# Altium project Matrix.PrjPCB
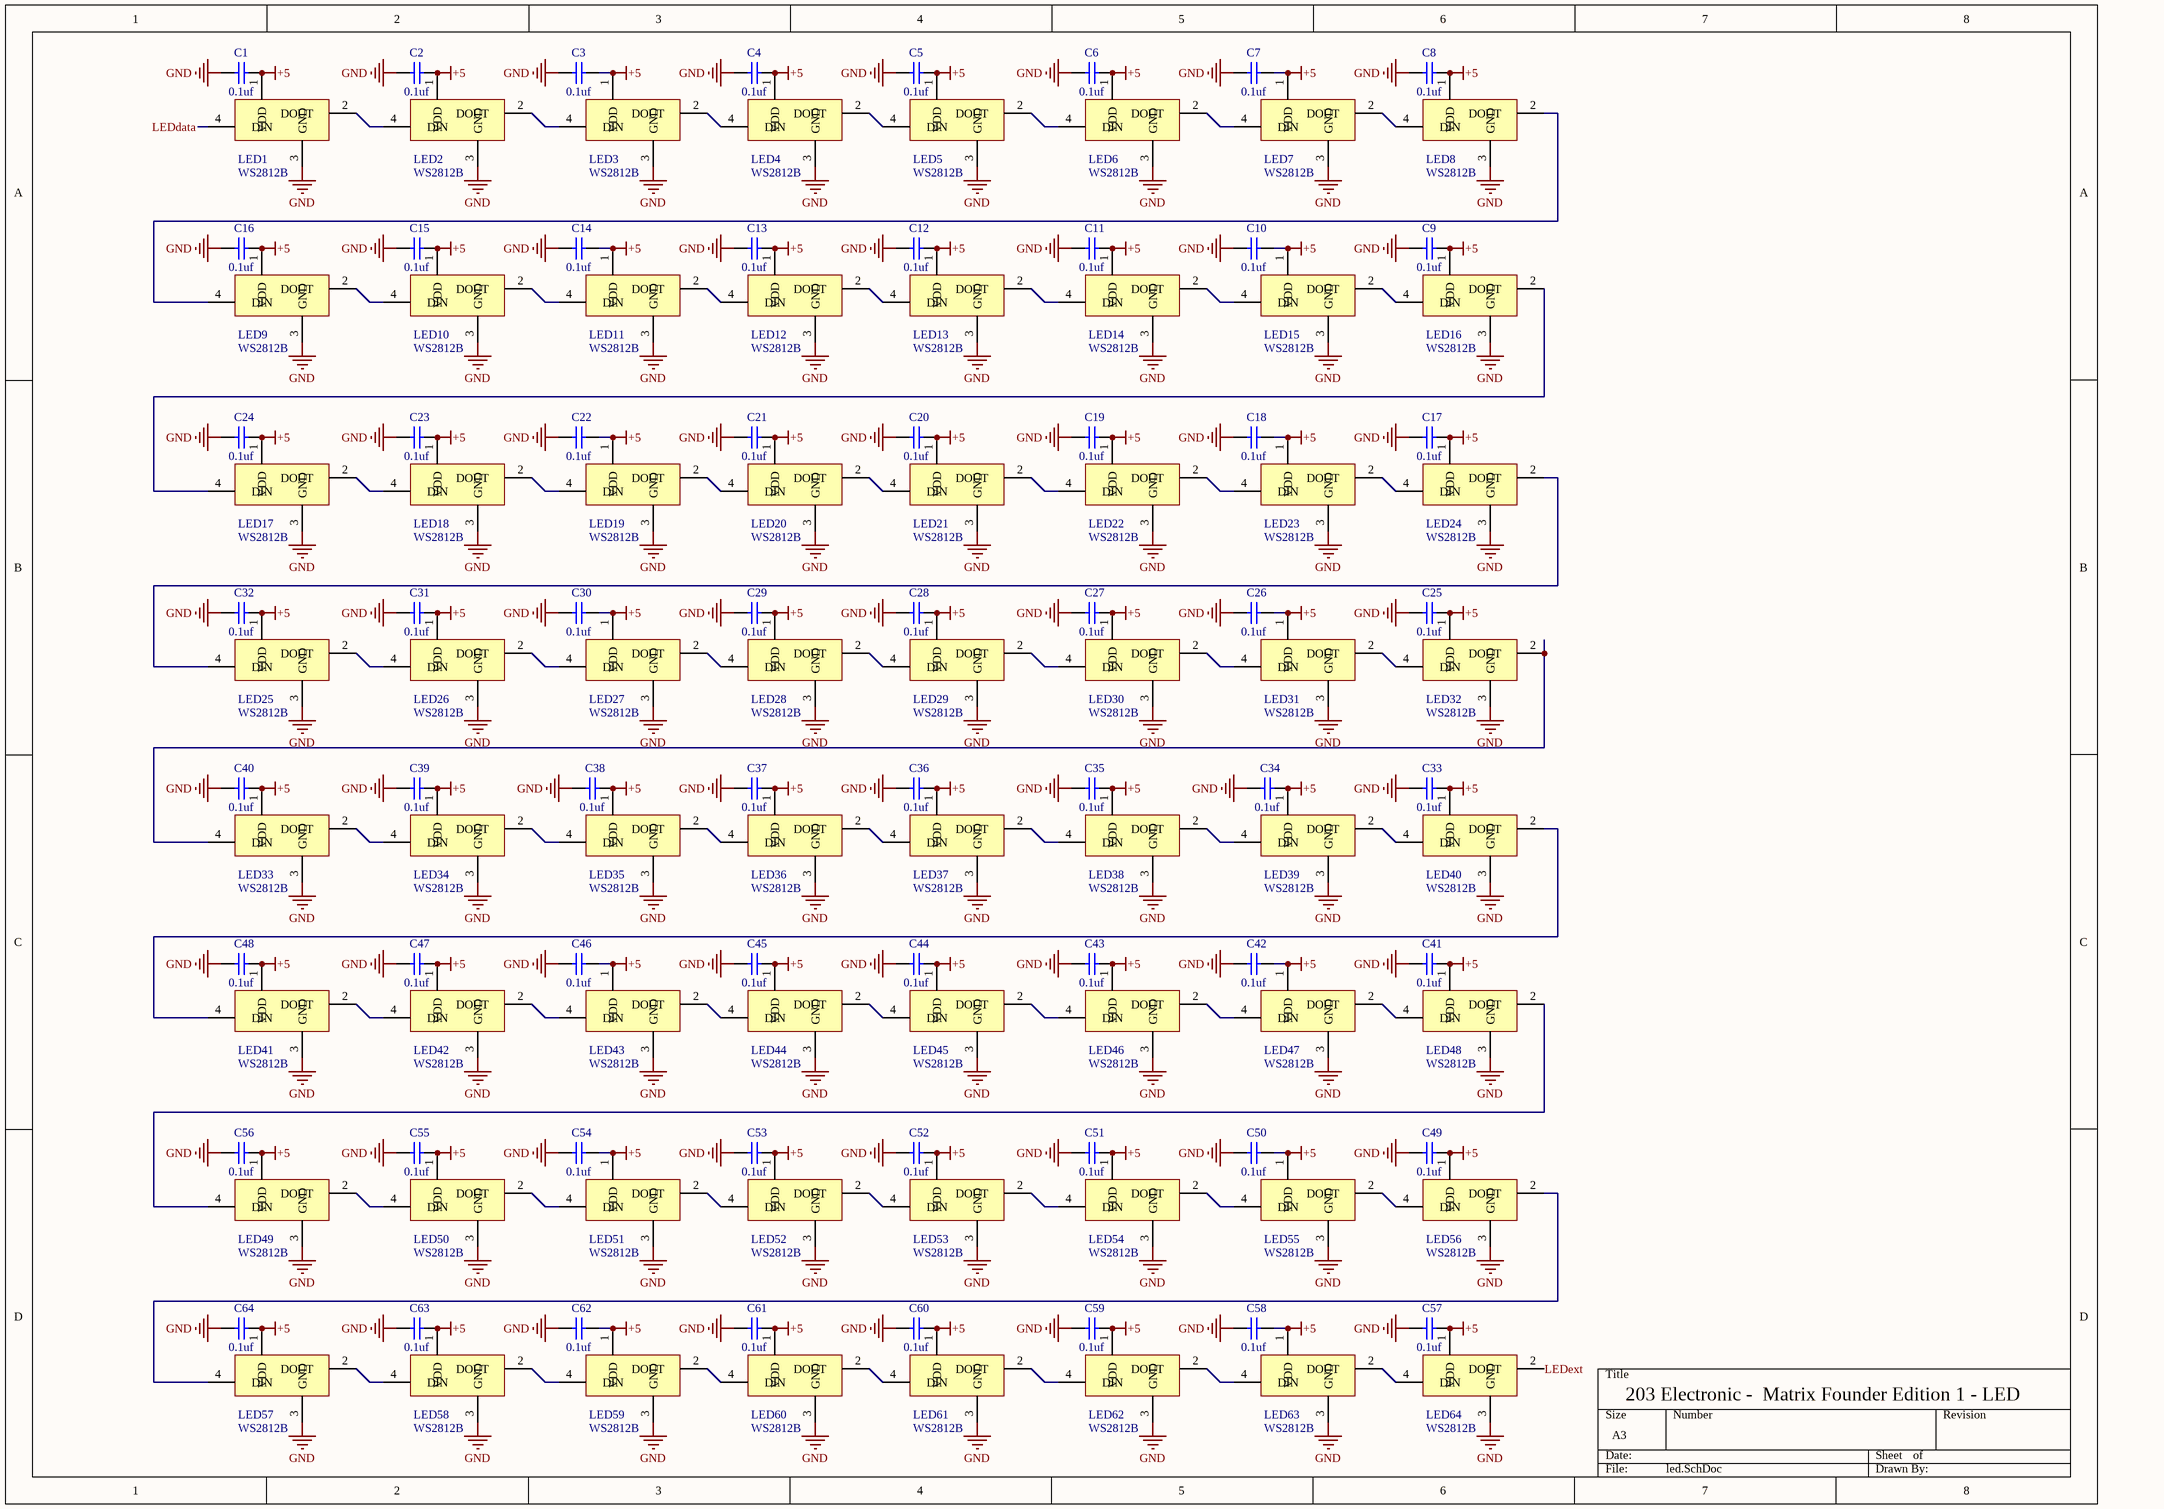
[diagram p0: led.SchDoc]
3 sheets, 303 parts. Net scope: global (net labels, ports and power ports of the same name join across sheets).
Board file: Matrix.PcbDoc
Sheets:
  led.SchDoc
  matrixkeypad.SchDoc
  MCU.SchDoc

## Sheet led.SchDoc
size A3

### Parts
(Parts that share a designator on the sheet are numbered #1, #2 ... from top to bottom, then left to right.)
C1#1  value 0.1uf  [0603 res]  (hidden comment: Cap Semi)
C2#1  value 0.1uf  [0603 res]  (hidden comment: Cap Semi)
C3#1  value 0.1uf  [0603 res]  (hidden comment: Cap Semi)
C4#1  value 0.1uf  [0603 res]  (hidden comment: Cap Semi)
C5#1  value 0.1uf  [0603 res]  (hidden comment: Cap Semi)
C6#1  value 0.1uf  [0603 res]  (hidden comment: Cap Semi)
C7#1  value 0.1uf  [0603 res]  (hidden comment: Cap Semi)
C8#1  value 0.1uf  [0603 res]  (hidden comment: Cap Semi)
C9#1  value 0.1uf  [0603 res]  (hidden comment: Cap Semi)
C10#1  value 0.1uf  [0603 res]  (hidden comment: Cap Semi)
C11#1  value 0.1uf  [0603 res]  (hidden comment: Cap Semi)
C12#1  value 0.1uf  [0603 res]  (hidden comment: Cap Semi)
C13  value 0.1uf  [0603 res]  (hidden comment: Cap Semi)
C14  value 0.1uf  [0603 res]  (hidden comment: Cap Semi)
C15  value 0.1uf  [0603 res]  (hidden comment: Cap Semi)
C16  value 0.1uf  [0603 res]  (hidden comment: Cap Semi)
C17  value 0.1uf  [0603 res]  (hidden comment: Cap Semi)
C18  value 0.1uf  [0603 res]  (hidden comment: Cap Semi)
C19  value 0.1uf  [0603 res]  (hidden comment: Cap Semi)
C20  value 0.1uf  [0603 res]  (hidden comment: Cap Semi)
C21  value 0.1uf  [0603 res]  (hidden comment: Cap Semi)
C22  value 0.1uf  [0603 res]  (hidden comment: Cap Semi)
C23  value 0.1uf  [0603 res]  (hidden comment: Cap Semi)
C24  value 0.1uf  [0603 res]  (hidden comment: Cap Semi)
C25  value 0.1uf  [0603 res]  (hidden comment: Cap Semi)
C26  value 0.1uf  [0603 res]  (hidden comment: Cap Semi)
C27  value 0.1uf  [0603 res]  (hidden comment: Cap Semi)
C28  value 0.1uf  [0603 res]  (hidden comment: Cap Semi)
C29  value 0.1uf  [0603 res]  (hidden comment: Cap Semi)
C30  value 0.1uf  [0603 res]  (hidden comment: Cap Semi)
C31  value 0.1uf  [0603 res]  (hidden comment: Cap Semi)
C32  value 0.1uf  [0603 res]  (hidden comment: Cap Semi)
C33  value 0.1uf  [0603 res]  (hidden comment: Cap Semi)
C34  value 0.1uf  [0603 res]  (hidden comment: Cap Semi)
C35  value 0.1uf  [0603 res]  (hidden comment: Cap Semi)
C36  value 0.1uf  [0603 res]  (hidden comment: Cap Semi)
C37  value 0.1uf  [0603 res]  (hidden comment: Cap Semi)
C38  value 0.1uf  [0603 res]  (hidden comment: Cap Semi)
C39  value 0.1uf  [0603 res]  (hidden comment: Cap Semi)
C40  value 0.1uf  [0603 res]  (hidden comment: Cap Semi)
C41  value 0.1uf  [0603 res]  (hidden comment: Cap Semi)
C42  value 0.1uf  [0603 res]  (hidden comment: Cap Semi)
C43  value 0.1uf  [0603 res]  (hidden comment: Cap Semi)
C44  value 0.1uf  [0603 res]  (hidden comment: Cap Semi)
C45  value 0.1uf  [0603 res]  (hidden comment: Cap Semi)
C46  value 0.1uf  [0603 res]  (hidden comment: Cap Semi)
C47  value 0.1uf  [0603 res]  (hidden comment: Cap Semi)
C48  value 0.1uf  [0603 res]  (hidden comment: Cap Semi)
C49  value 0.1uf  [0603 res]  (hidden comment: Cap Semi)
C50  value 0.1uf  [0603 res]  (hidden comment: Cap Semi)
C51  value 0.1uf  [0603 res]  (hidden comment: Cap Semi)
C52  value 0.1uf  [0603 res]  (hidden comment: Cap Semi)
C53  value 0.1uf  [0603 res]  (hidden comment: Cap Semi)
C54  value 0.1uf  [0603 res]  (hidden comment: Cap Semi)
C55  value 0.1uf  [0603 res]  (hidden comment: Cap Semi)
C56  value 0.1uf  [0603 res]  (hidden comment: Cap Semi)
C57  value 0.1uf  [0603 res]  (hidden comment: Cap Semi)
C58  value 0.1uf  [0603 res]  (hidden comment: Cap Semi)
C59  value 0.1uf  [0603 res]  (hidden comment: Cap Semi)
C60  value 0.1uf  [0603 res]  (hidden comment: Cap Semi)
C61  value 0.1uf  [0603 res]  (hidden comment: Cap Semi)
C62  value 0.1uf  [0603 res]  (hidden comment: Cap Semi)
C63  value 0.1uf  [0603 res]  (hidden comment: Cap Semi)
C64  value 0.1uf  [0603 res]  (hidden comment: Cap Semi)
LED1  WS2812B  [WS2812B]
LED2  WS2812B  [WS2812B]
LED3  WS2812B  [WS2812B]
LED4  WS2812B  [WS2812B]
LED5  WS2812B  [WS2812B]
LED6  WS2812B  [WS2812B]
LED7  WS2812B  [WS2812B]
LED8  WS2812B  [WS2812B]
LED9  WS2812B  [WS2812B]
LED10  WS2812B  [WS2812B]
LED11  WS2812B  [WS2812B]
LED12  WS2812B  [WS2812B]
LED13  WS2812B  [WS2812B]
LED14  WS2812B  [WS2812B]
LED15  WS2812B  [WS2812B]
LED16  WS2812B  [WS2812B]
LED17  WS2812B  [WS2812B]
LED18  WS2812B  [WS2812B]
LED19  WS2812B  [WS2812B]
LED20  WS2812B  [WS2812B]
LED21  WS2812B  [WS2812B]
LED22  WS2812B  [WS2812B]
LED23  WS2812B  [WS2812B]
LED24  WS2812B  [WS2812B]
LED25  WS2812B  [WS2812B]
LED26  WS2812B  [WS2812B]
LED27  WS2812B  [WS2812B]
LED28  WS2812B  [WS2812B]
LED29  WS2812B  [WS2812B]
LED30  WS2812B  [WS2812B]
LED31  WS2812B  [WS2812B]
LED32  WS2812B  [WS2812B]
LED33  WS2812B  [WS2812B]
LED34  WS2812B  [WS2812B]
LED35  WS2812B  [WS2812B]
LED36  WS2812B  [WS2812B]
LED37  WS2812B  [WS2812B]
LED38  WS2812B  [WS2812B]
LED39  WS2812B  [WS2812B]
LED40  WS2812B  [WS2812B]
LED41  WS2812B  [WS2812B]
LED42  WS2812B  [WS2812B]
LED43  WS2812B  [WS2812B]
LED44  WS2812B  [WS2812B]
LED45  WS2812B  [WS2812B]
LED46  WS2812B  [WS2812B]
LED47  WS2812B  [WS2812B]
LED48  WS2812B  [WS2812B]
LED49  WS2812B  [WS2812B]
LED50  WS2812B  [WS2812B]
LED51  WS2812B  [WS2812B]
LED52  WS2812B  [WS2812B]
LED53  WS2812B  [WS2812B]
LED54  WS2812B  [WS2812B]
LED55  WS2812B  [WS2812B]
LED56  WS2812B  [WS2812B]
LED57  WS2812B  [WS2812B]
LED58  WS2812B  [WS2812B]
LED59  WS2812B  [WS2812B]
LED60  WS2812B  [WS2812B]
LED61  WS2812B  [WS2812B]
LED62  WS2812B  [WS2812B]
LED63  WS2812B  [WS2812B]
LED64  WS2812B  [WS2812B]

### Nets
+5: C1#1.2 C2#1.2 C3#1.2 C4#1.2 C5#1.2 C6#1.2 C7#1.2 C8#1.2 C9#1.2 C10#1.2 C11#1.2 C12#1.2 C13.2 C14.2 C15.2 C16.2 C17.2 C18.2 C19.2 C20.2 C21.2 C22.2 C23.2 C24.2 C25.2 C26.2 C27.2 C28.2 C29.2 C30.2 C31.2 C32.2 C33.2 C34.2 C35.2 C36.2 C37.2 C38.2 C39.2 C40.2 C41.2 C42.2 C43.2 C44.2 C45.2 C46.2 C47.2 C48.2 C49.2 C50.2 C51.2 C52.2 C53.2 C54.2 C55.2 C56.2 C57.2 C58.2 C59.2 C60.2 C61.2 C62.2 C63.2 C64.2 LED1.1(VDD) LED2.1(VDD) LED3.1(VDD) LED4.1(VDD) LED5.1(VDD) LED6.1(VDD) LED7.1(VDD) LED8.1(VDD) LED9.1(VDD) LED10.1(VDD) LED11.1(VDD) LED12.1(VDD) LED13.1(VDD) LED14.1(VDD) LED15.1(VDD) LED16.1(VDD) LED17.1(VDD) LED18.1(VDD) LED19.1(VDD) LED20.1(VDD) LED21.1(VDD) LED22.1(VDD) LED23.1(VDD) LED24.1(VDD) LED25.1(VDD) LED26.1(VDD) LED27.1(VDD) LED28.1(VDD) LED29.1(VDD) LED30.1(VDD) LED31.1(VDD) LED32.1(VDD) LED33.1(VDD) LED34.1(VDD) LED35.1(VDD) LED36.1(VDD) LED37.1(VDD) LED38.1(VDD) LED39.1(VDD) LED40.1(VDD) LED41.1(VDD) LED42.1(VDD) LED43.1(VDD) LED44.1(VDD) LED45.1(VDD) LED46.1(VDD) LED47.1(VDD) LED48.1(VDD) LED49.1(VDD) LED50.1(VDD) LED51.1(VDD) LED52.1(VDD) LED53.1(VDD) LED54.1(VDD) LED55.1(VDD) LED56.1(VDD) LED57.1(VDD) LED58.1(VDD) LED59.1(VDD) LED60.1(VDD) LED61.1(VDD) LED62.1(VDD) LED63.1(VDD) LED64.1(VDD)
GND: C1#1.1 C2#1.1 C3#1.1 C4#1.1 C5#1.1 C6#1.1 C7#1.1 C8#1.1 C9#1.1 C10#1.1 C11#1.1 C12#1.1 C13.1 C14.1 C15.1 C16.1 C17.1 C18.1 C19.1 C20.1 C21.1 C22.1 C23.1 C24.1 C25.1 C26.1 C27.1 C28.1 C29.1 C30.1 C31.1 C32.1 C33.1 C34.1 C35.1 C36.1 C37.1 C38.1 C39.1 C40.1 C41.1 C42.1 C43.1 C44.1 C45.1 C46.1 C47.1 C48.1 C49.1 C50.1 C51.1 C52.1 C53.1 C54.1 C55.1 C56.1 C57.1 C58.1 C59.1 C60.1 C61.1 C62.1 C63.1 C64.1 LED1.3(GND) LED2.3(GND) LED3.3(GND) LED4.3(GND) LED5.3(GND) LED6.3(GND) LED7.3(GND) LED8.3(GND) LED9.3(GND) LED10.3(GND) LED11.3(GND) LED12.3(GND) LED13.3(GND) LED14.3(GND) LED15.3(GND) LED16.3(GND) LED17.3(GND) LED18.3(GND) LED19.3(GND) LED20.3(GND) LED21.3(GND) LED22.3(GND) LED23.3(GND) LED24.3(GND) LED25.3(GND) LED26.3(GND) LED27.3(GND) LED28.3(GND) LED29.3(GND) LED30.3(GND) LED31.3(GND) LED32.3(GND) LED33.3(GND) LED34.3(GND) LED35.3(GND) LED36.3(GND) LED37.3(GND) LED38.3(GND) LED39.3(GND) LED40.3(GND) LED41.3(GND) LED42.3(GND) LED43.3(GND) LED44.3(GND) LED45.3(GND) LED46.3(GND) LED47.3(GND) LED48.3(GND) LED49.3(GND) LED50.3(GND) LED51.3(GND) LED52.3(GND) LED53.3(GND) LED54.3(GND) LED55.3(GND) LED56.3(GND) LED57.3(GND) LED58.3(GND) LED59.3(GND) LED60.3(GND) LED61.3(GND) LED62.3(GND) LED63.3(GND) LED64.3(GND)  [project net BOOT1]
LEDdata: LED1.4(DIN)
LEDext: LED64.2(DOUT)
NetLED1_2: LED1.2(DOUT) LED2.4(DIN)
NetLED2_2: LED2.2(DOUT) LED3.4(DIN)
NetLED3_2: LED3.2(DOUT) LED4.4(DIN)
NetLED4_2: LED4.2(DOUT) LED5.4(DIN)
NetLED5_2: LED5.2(DOUT) LED6.4(DIN)
NetLED6_2: LED6.2(DOUT) LED7.4(DIN)
NetLED7_2: LED7.2(DOUT) LED8.4(DIN)
NetLED8_2: LED8.2(DOUT) LED9.4(DIN)
NetLED9_2: LED9.2(DOUT) LED10.4(DIN)
NetLED10_2: LED10.2(DOUT) LED11.4(DIN)
NetLED11_2: LED11.2(DOUT) LED12.4(DIN)
NetLED12_2: LED12.2(DOUT) LED13.4(DIN)
NetLED13_2: LED13.2(DOUT) LED14.4(DIN)
NetLED14_2: LED14.2(DOUT) LED15.4(DIN)
NetLED15_2: LED15.2(DOUT) LED16.4(DIN)
NetLED16_2: LED16.2(DOUT) LED17.4(DIN)
NetLED17_2: LED17.2(DOUT) LED18.4(DIN)
NetLED18_2: LED18.2(DOUT) LED19.4(DIN)
NetLED19_2: LED19.2(DOUT) LED20.4(DIN)
NetLED20_2: LED20.2(DOUT) LED21.4(DIN)
NetLED21_2: LED21.2(DOUT) LED22.4(DIN)
NetLED22_2: LED22.2(DOUT) LED23.4(DIN)
NetLED23_2: LED23.2(DOUT) LED24.4(DIN)
NetLED24_2: LED24.2(DOUT) LED25.4(DIN)
NetLED25_2: LED25.2(DOUT) LED26.4(DIN)
NetLED26_2: LED26.2(DOUT) LED27.4(DIN)
NetLED27_2: LED27.2(DOUT) LED28.4(DIN)
NetLED28_2: LED28.2(DOUT) LED29.4(DIN)
NetLED29_2: LED29.2(DOUT) LED30.4(DIN)
NetLED30_2: LED30.2(DOUT) LED31.4(DIN)
NetLED31_2: LED31.2(DOUT) LED32.4(DIN)
NetLED32_2: LED32.2(DOUT) LED33.4(DIN)
NetLED33_2: LED33.2(DOUT) LED34.4(DIN)
NetLED34_2: LED34.2(DOUT) LED35.4(DIN)
NetLED35_2: LED35.2(DOUT) LED36.4(DIN)
NetLED36_2: LED36.2(DOUT) LED37.4(DIN)
NetLED37_2: LED37.2(DOUT) LED38.4(DIN)
NetLED38_2: LED38.2(DOUT) LED39.4(DIN)
NetLED39_2: LED39.2(DOUT) LED40.4(DIN)
NetLED40_2: LED40.2(DOUT) LED41.4(DIN)
NetLED41_2: LED41.2(DOUT) LED42.4(DIN)
NetLED42_2: LED42.2(DOUT) LED43.4(DIN)
NetLED43_2: LED43.2(DOUT) LED44.4(DIN)
NetLED44_2: LED44.2(DOUT) LED45.4(DIN)
NetLED45_2: LED45.2(DOUT) LED46.4(DIN)
NetLED46_2: LED46.2(DOUT) LED47.4(DIN)
NetLED47_2: LED47.2(DOUT) LED48.4(DIN)
NetLED48_2: LED48.2(DOUT) LED49.4(DIN)
NetLED49_2: LED49.2(DOUT) LED50.4(DIN)
NetLED50_2: LED50.2(DOUT) LED51.4(DIN)
NetLED51_2: LED51.2(DOUT) LED52.4(DIN)
NetLED52_2: LED52.2(DOUT) LED53.4(DIN)
NetLED53_2: LED53.2(DOUT) LED54.4(DIN)
NetLED54_2: LED54.2(DOUT) LED55.4(DIN)
NetLED55_2: LED55.2(DOUT) LED56.4(DIN)
NetLED56_2: LED56.2(DOUT) LED57.4(DIN)
NetLED57_2: LED57.2(DOUT) LED58.4(DIN)
NetLED58_2: LED58.2(DOUT) LED59.4(DIN)
NetLED59_2: LED59.2(DOUT) LED60.4(DIN)
NetLED60_2: LED60.2(DOUT) LED61.4(DIN)
NetLED61_2: LED61.2(DOUT) LED62.4(DIN)
NetLED62_2: LED62.2(DOUT) LED63.4(DIN)
NetLED63_2: LED63.2(DOUT) LED64.4(DIN)

### Notes on the sheet
- 203 Electronic -  Matrix Founder Edition 1 - LED

### Library data of the parts
C1#1 C2#1 C3#1 C4#1 C5#1 C6#1 C7#1 C8#1 C9#1 C10#1 C11#1 C12#1 C13-C64 = Cap Semi: Capacitor (Semiconductor SIM Model); Published: 8-Jun-2000; LatestRevisionDate: 29-May-2009; LatestRevisionNote: IPC-7351 Footprint Added.; PackageReference: C1206; Publisher: Altium Limited; PackageDescription: Chip Capacitor
LED1-LED64 = WS2812B: 3535

## Sheet matrixkeypad.SchDoc
size A4
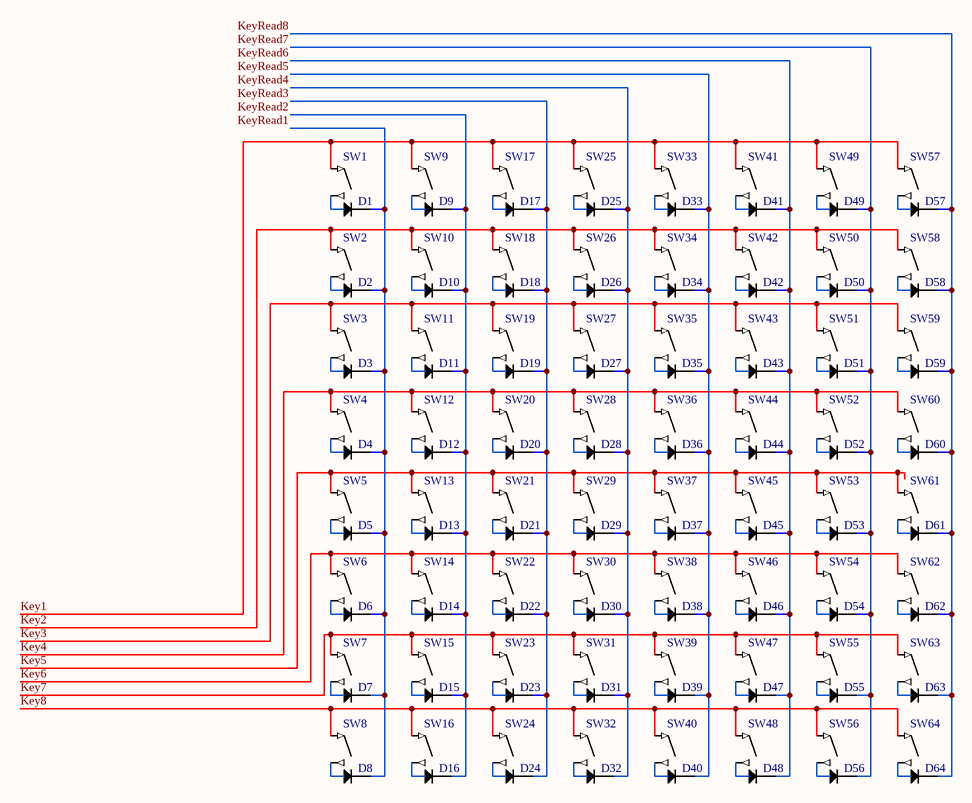
[diagram p1: matrixkeypad.SchDoc]

### Parts
D1  1N4148  [SOD123]  (value not drawn)
D2  1N4148  [SOD123]  (value not drawn)
D3  1N4148  [SOD123]  (value not drawn)
D4  1N4148  [SOD123]  (value not drawn)
D5  1N4148  [SOD123]  (value not drawn)
D6  1N4148  [SOD123]  (value not drawn)
D7  1N4148  [SOD123]  (value not drawn)
D8  1N4148  [SOD123]  (value not drawn)
D9  1N4148  [SOD123]  (value not drawn)
D10  1N4148  [SOD123]  (value not drawn)
D11  1N4148  [SOD123]  (value not drawn)
D12  1N4148  [SOD123]  (value not drawn)
D13  1N4148  [SOD123]  (value not drawn)
D14  1N4148  [SOD123]  (value not drawn)
D15  1N4148  [SOD123]  (value not drawn)
D16  1N4148  [SOD123]  (value not drawn)
D17  1N4148  [SOD123]  (value not drawn)
D18  1N4148  [SOD123]  (value not drawn)
D19  1N4148  [SOD123]  (value not drawn)
D20  1N4148  [SOD123]  (value not drawn)
D21  1N4148  [SOD123]  (value not drawn)
D22  1N4148  [SOD123]  (value not drawn)
D23  1N4148  [SOD123]  (value not drawn)
D24  1N4148  [SOD123]  (value not drawn)
D25  1N4148  [SOD123]  (value not drawn)
D26  1N4148  [SOD123]  (value not drawn)
D27  1N4148  [SOD123]  (value not drawn)
D28  1N4148  [SOD123]  (value not drawn)
D29  1N4148  [SOD123]  (value not drawn)
D30  1N4148  [SOD123]  (value not drawn)
D31  1N4148  [SOD123]  (value not drawn)
D32  1N4148  [SOD123]  (value not drawn)
D33  1N4148  [SOD123]  (value not drawn)
D34  1N4148  [SOD123]  (value not drawn)
D35  1N4148  [SOD123]  (value not drawn)
D36  1N4148  [SOD123]  (value not drawn)
D37  1N4148  [SOD123]  (value not drawn)
D38  1N4148  [SOD123]  (value not drawn)
D39  1N4148  [SOD123]  (value not drawn)
D40  1N4148  [SOD123]  (value not drawn)
D41  1N4148  [SOD123]  (value not drawn)
D42  1N4148  [SOD123]  (value not drawn)
D43  1N4148  [SOD123]  (value not drawn)
D44  1N4148  [SOD123]  (value not drawn)
D45  1N4148  [SOD123]  (value not drawn)
D46  1N4148  [SOD123]  (value not drawn)
D47  1N4148  [SOD123]  (value not drawn)
D48  1N4148  [SOD123]  (value not drawn)
D49  1N4148  [SOD123]  (value not drawn)
D50  1N4148  [SOD123]  (value not drawn)
D51  1N4148  [SOD123]  (value not drawn)
D52  1N4148  [SOD123]  (value not drawn)
D53  1N4148  [SOD123]  (value not drawn)
D54  1N4148  [SOD123]  (value not drawn)
D55  1N4148  [SOD123]  (value not drawn)
D56  1N4148  [SOD123]  (value not drawn)
D57  1N4148  [SOD123]  (value not drawn)
D58  1N4148  [SOD123]  (value not drawn)
D59  1N4148  [SOD123]  (value not drawn)
D60  1N4148  [SOD123]  (value not drawn)
D61  1N4148  [SOD123]  (value not drawn)
D62  1N4148  [SOD123]  (value not drawn)
D63  1N4148  [SOD123]  (value not drawn)
D64  1N4148  [SOD123]  (value not drawn)
SW1  (no value)  [PAD]
SW2  (no value)  [PAD]
SW3  (no value)  [PAD]
SW4  (no value)  [PAD]
SW5  (no value)  [PAD]
SW6  (no value)  [PAD]
SW7  (no value)  [PAD]
SW8  (no value)  [PAD]
SW9  (no value)  [PAD]
SW10  (no value)  [PAD]
SW11  (no value)  [PAD]
SW12  (no value)  [PAD]
SW13  (no value)  [PAD]
SW14  (no value)  [PAD]
SW15  (no value)  [PAD]
SW16  (no value)  [PAD]
SW17  (no value)  [PAD]
SW18  (no value)  [PAD]
SW19  (no value)  [PAD]
SW20  (no value)  [PAD]
SW21  (no value)  [PAD]
SW22  (no value)  [PAD]
SW23  (no value)  [PAD]
SW24  (no value)  [PAD]
SW25  (no value)  [PAD]
SW26  (no value)  [PAD]
SW27  (no value)  [PAD]
SW28  (no value)  [PAD]
SW29  (no value)  [PAD]
SW30  (no value)  [PAD]
SW31  (no value)  [PAD]
SW32  (no value)  [PAD]
SW33  (no value)  [PAD]
SW34  (no value)  [PAD]
SW35  (no value)  [PAD]
SW36  (no value)  [PAD]
SW37  (no value)  [PAD]
SW38  (no value)  [PAD]
SW39  (no value)  [PAD]
SW40  (no value)  [PAD]
SW41  (no value)  [PAD]
SW42  (no value)  [PAD]
SW43  (no value)  [PAD]
SW44  (no value)  [PAD]
SW45  (no value)  [PAD]
SW46  (no value)  [PAD]
SW47  (no value)  [PAD]
SW48  (no value)  [PAD]
SW49  (no value)  [PAD]
SW50  (no value)  [PAD]
SW51  (no value)  [PAD]
SW52  (no value)  [PAD]
SW53  (no value)  [PAD]
SW54  (no value)  [PAD]
SW55  (no value)  [PAD]
SW56  (no value)  [PAD]
SW57  (no value)  [PAD]
SW58  (no value)  [PAD]
SW59  (no value)  [PAD]
SW60  (no value)  [PAD]
SW61  (no value)  [PAD]
SW62  (no value)  [PAD]
SW63  (no value)  [PAD]
SW64  (no value)  [PAD]

### Nets
Key1: SW1.1 SW9.1 SW17.1 SW25.1 SW33.1 SW41.1 SW49.1 SW57.1
Key2: SW2.1 SW10.1 SW18.1 SW26.1 SW34.1 SW42.1 SW50.1 SW58.1
Key3: SW3.1 SW11.1 SW19.1 SW27.1 SW35.1 SW43.1 SW51.1 SW59.1
Key4: SW4.1 SW12.1 SW20.1 SW28.1 SW36.1 SW44.1 SW52.1 SW60.1
Key5: SW5.1 SW13.1 SW21.1 SW29.1 SW37.1 SW45.1 SW53.1 SW61.1
Key6: SW6.1 SW14.1 SW22.1 SW30.1 SW38.1 SW46.1 SW54.1 SW62.1
Key7: SW7.1 SW15.1 SW23.1 SW31.1 SW39.1 SW47.1 SW55.1 SW63.1
Key8: SW8.1 SW16.1 SW24.1 SW32.1 SW40.1 SW48.1 SW56.1 SW64.1
KeyRead1: D1.2 D2.2 D3.2 D4.2 D5.2 D6.2 D7.2 D8.2
KeyRead2: D9.2 D10.2 D11.2 D12.2 D13.2 D14.2 D15.2 D16.2
KeyRead3: D17.2 D18.2 D19.2 D20.2 D21.2 D22.2 D23.2 D24.2
KeyRead4: D25.2 D26.2 D27.2 D28.2 D29.2 D30.2 D31.2 D32.2
KeyRead5: D33.2 D34.2 D35.2 D36.2 D37.2 D38.2 D39.2 D40.2
KeyRead6: D41.2 D42.2 D43.2 D44.2 D45.2 D46.2 D47.2 D48.2
KeyRead7: D49.2 D50.2 D51.2 D52.2 D53.2 D54.2 D55.2 D56.2
KeyRead8: D57.2 D58.2 D59.2 D60.2 D61.2 D62.2 D63.2 D64.2
NetD1_1: D1.1 SW1.2(Out)
NetD2_1: D2.1 SW2.2(Out)
NetD3_1: D3.1 SW3.2(Out)
NetD4_1: D4.1 SW4.2(Out)
NetD5_1: D5.1 SW5.2(Out)
NetD6_1: D6.1 SW6.2(Out)
NetD7_1: D7.1 SW7.2(Out)
NetD8_1: D8.1 SW8.2(Out)
NetD9_1: D9.1 SW9.2(Out)
NetD10_1: D10.1 SW10.2(Out)
NetD11_1: D11.1 SW11.2(Out)
NetD12_1: D12.1 SW12.2(Out)
NetD13_1: D13.1 SW13.2(Out)
NetD14_1: D14.1 SW14.2(Out)
NetD15_1: D15.1 SW15.2(Out)
NetD16_1: D16.1 SW16.2(Out)
NetD17_1: D17.1 SW17.2(Out)
NetD18_1: D18.1 SW18.2(Out)
NetD19_1: D19.1 SW19.2(Out)
NetD20_1: D20.1 SW20.2(Out)
NetD21_1: D21.1 SW21.2(Out)
NetD22_1: D22.1 SW22.2(Out)
NetD23_1: D23.1 SW23.2(Out)
NetD24_1: D24.1 SW24.2(Out)
NetD25_1: D25.1 SW25.2(Out)
NetD26_1: D26.1 SW26.2(Out)
NetD27_1: D27.1 SW27.2(Out)
NetD28_1: D28.1 SW28.2(Out)
NetD29_1: D29.1 SW29.2(Out)
NetD30_1: D30.1 SW30.2(Out)
NetD31_1: D31.1 SW31.2(Out)
NetD32_1: D32.1 SW32.2(Out)
NetD33_1: D33.1 SW33.2(Out)
NetD34_1: D34.1 SW34.2(Out)
NetD35_1: D35.1 SW35.2(Out)
NetD36_1: D36.1 SW36.2(Out)
NetD37_1: D37.1 SW37.2(Out)
NetD38_1: D38.1 SW38.2(Out)
NetD39_1: D39.1 SW39.2(Out)
NetD40_1: D40.1 SW40.2(Out)
NetD41_1: D41.1 SW41.2(Out)
NetD42_1: D42.1 SW42.2(Out)
NetD43_1: D43.1 SW43.2(Out)
NetD44_1: D44.1 SW44.2(Out)
NetD45_1: D45.1 SW45.2(Out)
NetD46_1: D46.1 SW46.2(Out)
NetD47_1: D47.1 SW47.2(Out)
NetD48_1: D48.1 SW48.2(Out)
NetD49_1: D49.1 SW49.2(Out)
NetD50_1: D50.1 SW50.2(Out)
NetD51_1: D51.1 SW51.2(Out)
NetD52_1: D52.1 SW52.2(Out)
NetD53_1: D53.1 SW53.2(Out)
NetD54_1: D54.1 SW54.2(Out)
NetD55_1: D55.1 SW55.2(Out)
NetD56_1: D56.1 SW56.2(Out)
NetD57_1: D57.1 SW57.2(Out)
NetD58_1: D58.1 SW58.2(Out)
NetD59_1: D59.1 SW59.2(Out)
NetD60_1: D60.1 SW60.2(Out)
NetD61_1: D61.1 SW61.2(Out)
NetD62_1: D62.1 SW62.2(Out)
NetD63_1: D63.1 SW63.2(Out)
NetD64_1: D64.1 SW64.2(Out)

### Library data of the parts
SW1-SW64 = SW

## Sheet MCU.SchDoc: 203 Matrix - Core
size 320 x 193 mm; Revision: FE V1.0
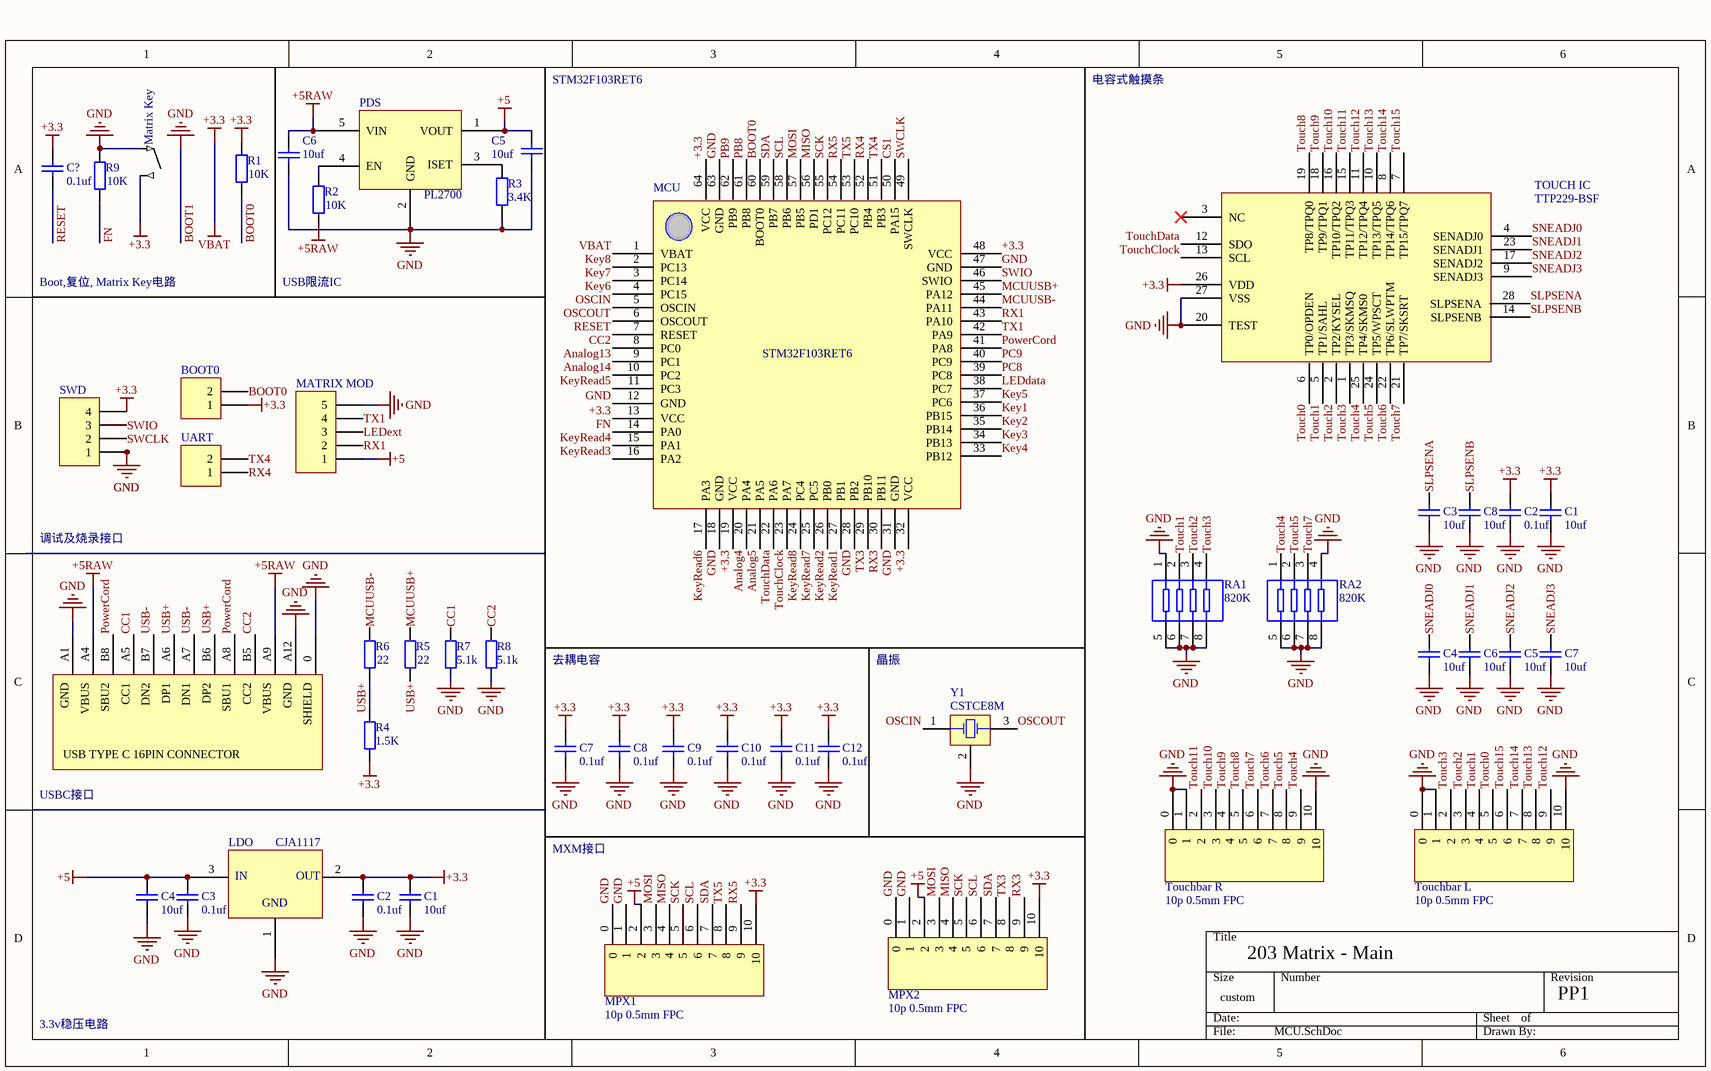
[diagram p2: MCU.SchDoc]

### Parts
(Parts that share a designator on the sheet are numbered #1, #2 ... from top to bottom, then left to right.)
BOOT0  MHDR1X2  [MHDR1X2]  (value not drawn)
C1#2  value 10uf  [1608[0603]]  (hidden comment: Cap Semi)
C1#3  value 10uf  [1608[0603]]  (hidden comment: System)
C2#2  value 0.1uf  [1608[0603]]  (hidden comment: Cap Semi)
C2#3  value 0.1uf  [1608[0603]]  (hidden comment: System)
C3#2  value 10uf  [1608[0603]]  (hidden comment: 50PF NR0)
C3#3  value 0.1uf  [1608[0603]]  (hidden comment: System)
C4#2  value 10uf  [1608[0603]]  (hidden comment: 50PF NR0)
C4#3  value 10uf  [1608[0603]]  (hidden comment: System)
C5#2  value 10uf  [1608[0603]]  (hidden comment: System)
C5#3  value 10uf  [1608[0603]]  (hidden comment: 50PF NR0)
C6#2  value 10uf  [1608[0603]]  (hidden comment: System)
C6#3  value 10uf  [1608[0603]]  (hidden comment: 50PF NR0)
C7#2  value 10uf  [1608[0603]]  (hidden comment: 50PF NR0)
C7#3  value 0.1uf  [1608[0603]]  (hidden comment: System)
C8#2  value 10uf  [1608[0603]]  (hidden comment: 50PF NR0)
C8#3  value 0.1uf  [1608[0603]]  (hidden comment: System)
C9#2  value 0.1uf  [1608[0603]]  (hidden comment: System)
C10#2  value 0.1uf  [1608[0603]]  (hidden comment: System)
C11#2  value 0.1uf  [1608[0603]]  (hidden comment: System)
C12#2  value 0.1uf  [1608[0603]]  (hidden comment: System)
C?  value 0.1uf  [1608[0603]]  (hidden comment: System)
LDO  CJA1117  [SOT89-3L]
Matrix_Key  Comment  [sw5x5]  (value not drawn)
MATRIX_MOD  MHDR1X5  [MHDR1X5]  (value not drawn)
MCU  RET6  [STM-LQFP64_L]  (value not drawn)
MPX1  10p 0.5mm FPC  [10P FPC 0.5mm]
MPX2  10p 0.5mm FPC  [10P FPC 0.5mm]
PDS  PL2700  [SOT23-5]
R1  value 10K  [1608[0603]]  (hidden comment: Res2)
R2  value 10K  [1608[0603]]  (hidden comment: Res2)
R3  value 3.4K  [1608[0603]]  (hidden comment: Res2)
R4  value 1.5K  [1608[0603]]  (hidden comment: System)
R5  value 22  [1608[0603]]  (hidden comment: System)
R6  value 22  [1608[0603]]  (hidden comment: System)
R7  value 5.1k  [1608[0603]]  (hidden comment: System)
R8  value 5.1k  [1608[0603]]  (hidden comment: System)
R9  value 10K  [1608[0603]]  (hidden comment: Res2)
RA1  820K  [8P4R]
RA2  820K  [8P4R]
SWD  SWD  [HDR1X4]  (value not drawn)
TOUCH_IC  TTP229-BSF  [SSOP-28]
Touchbar_L  10p 0.5mm FPC  [10P FPC 0.5mm]
Touchbar_R  10p 0.5mm FPC  [10P FPC 0.5mm]
UART  Comment  [HDR1X2]  (value not drawn)
USB-C  USBC 16PIN  [USBC 16PIN -1.6]  (value not drawn)
Y1  CSTCE8M  [CSTCE]

### Nets
+3.3: BOOT0.1 C1#2.2 C1#3.2 C2#2.2 C2#3.2 C7#3.2 C8#3.2 C9#2.2 C10#2.2 C11#2.2 C12#2.2 C?.2 LDO.2 Matrix_Key.2(Out) MCU.1(VBAT) MCU.13(VCC) MCU.19(VCC) MCU.32(VCC) MCU.48(VCC) MCU.64(VCC) MPX1.10 MPX2.10 R1.2 R4.2 SWD.4 TOUCH_IC.26(VDD)  [also labelled VBAT]
+5: C3#3.2 C4#3.2 C5#2.1 LDO.3 MATRIX_MOD.1 MPX1.2 MPX2.2 PDS.1(VOUT)
+5RAW: C6#2.1 PDS.5(VIN) R2.1 USB-C.A4 USB-C.A9
BOOT1: C1#2.1 C1#3.1 C2#2.1 C2#3.1 C3#2.1 C3#3.1 C4#2.1 C4#3.1 C5#2.2 C5#3.1 C6#2.2 C6#3.1 C7#2.1 C7#3.1 C8#2.1 C8#3.1 C9#2.1 C10#2.1 C11#2.1 C12#2.1 LDO.1 Matrix_Key.1 MATRIX_MOD.5 MCU.12(GND) MCU.18(GND) MCU.28(PB2) MCU.31(GND) MCU.47(GND) MCU.63(GND) MPX1.0 MPX1.1 MPX2.0 MPX2.1 PDS.2(GND) R3.2 R7.2 R8.2 R9.2 RA1.1 RA1.5 RA1.6 RA1.7 RA1.8 RA2.4 RA2.5 RA2.6 RA2.7 RA2.8 SWD.1 TOUCH_IC.20(TEST) TOUCH_IC.27(VSS) Touchbar_L.0 Touchbar_L.1 Touchbar_L.10 Touchbar_R.0 Touchbar_R.1 Touchbar_R.10 USB-C.0 USB-C.A1 USB-C.A12  [also labelled GND]
Analog4: MCU.20(PA4)
Analog5: MCU.21(PA5)
Analog13: MCU.9(PC1)
Analog14: MCU.10(PC2)
BOOT0: BOOT0.2 MCU.60(BOOT0) R1.1
CC1: R7.1 USB-C.A5
CC2: MCU.8(PC0) R8.1 USB-C.B5
CS1: MCU.50(PA15)
FN: MCU.14(PA0) R9.1
Key1: MCU.36(PB15)
Key2: MCU.35(PB14)
Key3: MCU.34(PB13)
Key4: MCU.33(PB12)
Key5: MCU.37(PC6)
Key6: MCU.4(PC15)
Key7: MCU.3(PC14)
Key8: MCU.2(PC13)
KeyRead1: MCU.27(PB1)
KeyRead2: MCU.26(PB0)
KeyRead3: MCU.16(PA2)
KeyRead4: MCU.15(PA1)
KeyRead5: MCU.11(PC3)
KeyRead6: MCU.17(PA3)
KeyRead7: MCU.25(PC5)
KeyRead8: MCU.24(PC4)
LEDdata: MCU.38(PC7)
LEDext: MATRIX_MOD.3
MCUUSB+: MCU.45(PA12) R5.2
MCUUSB-: MCU.44(PA11) R6.2
MISO: MCU.56(PD1) MPX1.4 MPX2.4
MOSI: MCU.57(PB5) MPX1.3 MPX2.3
OSCIN: MCU.5(OSCIN) Y1.1(OSC1)
OSCOUT: MCU.6(OSCOUT) Y1.3(OSC2)
PB8: MCU.61(PB8)
PB9: MCU.62(PB9)
PC8: MCU.39(PC8)
PC9: MCU.40(PC9)
PowerCord: MCU.41(PA8) USB-C.A8 USB-C.B8
RESET: C?.1 MCU.7(RESET)
RX1: MATRIX_MOD.2 MCU.43(PA10)
RX3: MCU.30(PB11) MPX2.9
RX4: MCU.52(PB4) UART.1
RX5: MCU.54(PC11) MPX1.9
SCK: MCU.55(PC12) MPX1.5 MPX2.5
SCL: MCU.58(PB6) MPX1.6 MPX2.6
SDA: MCU.59(PB7) MPX1.7 MPX2.7
SLPSENA: C3#2.2 TOUCH_IC.28(SLPSENA)
SLPSENB: C8#2.2 TOUCH_IC.14(SLPSENB)
SNEADJ0: C4#2.2 TOUCH_IC.4(SENADJ0)
SNEADJ1: C6#3.2 TOUCH_IC.23(SENADJ1)
SNEADJ2: C5#3.2 TOUCH_IC.17(SENADJ2)
SNEADJ3: C7#2.2 TOUCH_IC.9(SENADJ3)
SWCLK: MCU.49(SWCLK) SWD.2
SWIO: MCU.46(SWIO) SWD.3
Touch0: TOUCH_IC.6(TP0/OPDEN) Touchbar_L.5
Touch1: RA1.2 TOUCH_IC.5(TP1/SAHL) Touchbar_L.4
Touch2: RA1.3 TOUCH_IC.2(TP2/KYSEL) Touchbar_L.3
Touch3: RA1.4 TOUCH_IC.1(TP3/SKMSQ) Touchbar_L.2
Touch4: RA2.1 TOUCH_IC.25(TP4/SKMS0) Touchbar_R.9
Touch5: RA2.2 TOUCH_IC.24(TP5/WPSCT) Touchbar_R.8
Touch6: TOUCH_IC.22(TP6/SLWPTM) Touchbar_R.7
Touch7: RA2.3 TOUCH_IC.21(TP7/SKSRT) Touchbar_R.6
Touch8: TOUCH_IC.19(TP8/TPQ0) Touchbar_R.5
Touch9: TOUCH_IC.18(TP9/TPQ1) Touchbar_R.4
Touch10: TOUCH_IC.16(TP10/TPQ2) Touchbar_R.3
Touch11: TOUCH_IC.15(TP11/TPQ3) Touchbar_R.2
Touch12: TOUCH_IC.11(TP12/TPQ4) Touchbar_L.9
Touch13: TOUCH_IC.10(TP13/TPQ5) Touchbar_L.8
Touch14: TOUCH_IC.8(TP14/TPQ6) Touchbar_L.7
Touch15: TOUCH_IC.7(TP15/TPQ7) Touchbar_L.6
TouchClock: MCU.23(PA7) TOUCH_IC.13(SCL)
TouchData: MCU.22(PA6) TOUCH_IC.12(SDO)
TX1: MATRIX_MOD.4 MCU.42(PA9)
TX3: MCU.29(PB10) MPX2.8
TX4: MCU.51(PB3) UART.2
TX5: MCU.53(PC10) MPX1.8
USB+: R4.1 R5.1 R6.1 USB-C.A6 USB-C.B6
USB-: USB-C.A7 USB-C.B7
NetPDS_3: PDS.3(ISET) R3.2
NetPDS_4: PDS.4(EN) R2.2

Not connected (* = marked no-connect by the designer): TOUCH_IC 3(NC)*; Y1 2(NC)

### Notes on the sheet
- STM32F103RET6
- 电容式触摸条
- Boot,复位, Matrix Key电路
- USB限流IC
- 调试及烧录接口
- 去耦电容
- 晶振
- USBC接口
- MXM接口
- 203 Matrix - Main
- PP1
- 3.3v稳压电路
- Labels drawn without touching a wire or pin: GND
- (in symbol CJA1117) IN; OUT; GND
- (in symbol RET6) STM32F103RET6
- (in symbol USBC 16PIN) GND; VBUS; SBU2; CC1; DN2; DP1; DN1; DP2; SBU1; CC2; SHIELD; USB TYPE C 16PIN CONNECTOR

### Library data of the parts
BOOT0 UART = MHDR1X2: Header, 2-Pin; LatestRevisionDate: 17-Jul-2002; LatestRevisionNote: Re-released for DXP Platform.; Publisher: Altium Limited
C1#2 C2#2 C3#2 C4#2 C5#3 C6#3 C7#2 C8#2 = Cap: System; Published: 8-Jun-2000; LatestRevisionDate: 17-Jul-2002; LatestRevisionNote: Re-released for DXP Platform.; PackageReference: RAD-0.3; Publisher: Altium Limited; PackageDescription: Radial Cap, Thru-Hole; 2 Leads; 0.3 in Pin Spacing
C1#3 C2#3 C3#3 C4#3 C5#2 C6#2 C7#3 C8#3 C9#2 C10#2 C11#2 C12#2 C? = Cap: Published: 8-Jun-2000; LatestRevisionDate: 17-Jul-2002; LatestRevisionNote: Re-released for DXP Platform.; PackageReference: RAD-0.3; Publisher: Altium Limited; PackageDescription: Radial Cap, Thru-Hole; 2 Leads; 0.3 in Pin Spacing
Matrix_Key = SW: System
MATRIX_MOD = MHDR1X5: Header, 5-Pin; LatestRevisionDate: 17-Jul-2002; LatestRevisionNote: Re-released for DXP Platform.; Publisher: Altium Limited
MPX1 MPX2 Touchbar_L Touchbar_R = 10 pin fpc
R1-R3 R9 = Res2: System; Published: 8-Jun-2000; LatestRevisionDate: 17-Jul-2002; LatestRevisionNote: Re-released for DXP Platform.; PackageReference: AXIAL-0.4; Publisher: Altium Limited; PackageDescription: Axial Device, Thru-Hole; 2 Leads; 0.4 in Pin Spacing
R4-R8 = Res2: Published: 8-Jun-2000; LatestRevisionDate: 17-Jul-2002; LatestRevisionNote: Re-released for DXP Platform.; PackageReference: AXIAL-0.4; Publisher: Altium Limited; PackageDescription: Axial Device, Thru-Hole; 2 Leads; 0.4 in Pin Spacing
RA1 RA2 = 4R8P Resistor
SWD = Header 4: System; LatestRevisionDate: 17-Jul-2002; LatestRevisionNote: Re-released for DXP Platform.; Publisher: Altium Limited
USB-C = USBC 16PIN: System
Y1 = 3225Crystal_1

## Nets that join several sheets
+5: led (128 pins), MCU (8 pins)
BOOT1: led (128 pins), MCU (60 pins)
Key1: matrixkeypad (8 pins), MCU (MCU.36)
Key2: matrixkeypad (8 pins), MCU (MCU.35)
Key3: matrixkeypad (8 pins), MCU (MCU.34)
Key4: matrixkeypad (8 pins), MCU (MCU.33)
Key5: matrixkeypad (8 pins), MCU (MCU.37)
Key6: matrixkeypad (8 pins), MCU (MCU.4)
Key7: matrixkeypad (8 pins), MCU (MCU.3)
Key8: matrixkeypad (8 pins), MCU (MCU.2)
KeyRead1: matrixkeypad (8 pins), MCU (MCU.27)
KeyRead2: matrixkeypad (8 pins), MCU (MCU.26)
KeyRead3: matrixkeypad (8 pins), MCU (MCU.16)
KeyRead4: matrixkeypad (8 pins), MCU (MCU.15)
KeyRead5: matrixkeypad (8 pins), MCU (MCU.11)
KeyRead6: matrixkeypad (8 pins), MCU (MCU.17)
KeyRead7: matrixkeypad (8 pins), MCU (MCU.25)
KeyRead8: matrixkeypad (8 pins), MCU (MCU.24)
LEDdata: led (LED1.4), MCU (MCU.38)
LEDext: led (LED64.2), MCU (MATRIX_MOD.3)